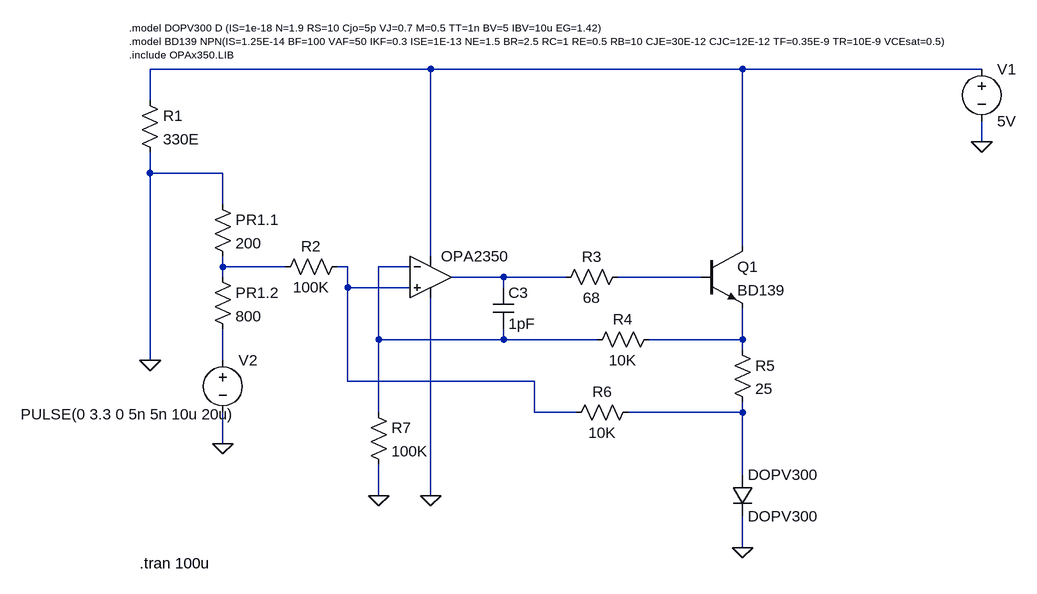
[diagram p0: schematic LaserDriver.asc]
LaserDriver.asc, the LTspice schematic file:
Version 4.1
SHEET 1 2252 680
WIRE 208 -192 -224 -192
WIRE 688 -192 208 -192
WIRE 1056 -192 688 -192
WIRE -224 -144 -224 -192
WIRE 1056 -80 1056 -112
WIRE -224 -32 -224 -64
WIRE -112 -32 -224 -32
WIRE -112 16 -112 -32
WIRE 688 80 688 -192
WIRE 208 96 208 -192
WIRE -112 112 -112 96
WIRE -16 112 -112 112
WIRE 80 112 64 112
WIRE 176 112 128 112
WIRE -112 128 -112 112
WIRE 320 128 240 128
WIRE 416 128 320 128
WIRE 624 128 496 128
WIRE 80 144 80 112
WIRE 176 144 80 144
WIRE 320 144 320 128
WIRE 128 224 128 112
WIRE 320 224 320 208
WIRE 320 224 128 224
WIRE 464 224 320 224
WIRE 688 224 688 176
WIRE 688 224 544 224
WIRE 688 240 688 224
WIRE -224 256 -224 -32
WIRE -112 256 -112 208
WIRE 80 288 80 144
WIRE 368 288 80 288
WIRE 128 336 128 224
WIRE 368 336 368 288
WIRE 432 336 368 336
WIRE 688 336 688 320
WIRE 688 336 512 336
WIRE -112 384 -112 336
WIRE 688 432 688 336
WIRE 128 464 128 416
WIRE 208 464 208 160
WIRE 688 544 688 496
FLAG -224 256 0
FLAG 128 464 0
FLAG 208 464 0
FLAG 688 544 0
FLAG 1056 -80 0
FLAG -112 384 0
DATAFLAG 784 400 "I(DOPV300)"
DATAFLAG 688 352 ""
SYMBOL npn 624 80 R0
SYMATTR InstName Q1
SYMATTR Value BD139
SYMBOL res -240 -160 R0
SYMATTR InstName R1
SYMATTR Value 330E
SYMBOL res -128 112 R0
SYMATTR InstName PR1.2
SYMATTR Value 800
SYMBOL res -128 0 R0
SYMATTR InstName PR1.1
SYMATTR Value 200
SYMBOL res 80 96 R90
WINDOW 0 0 56 VBottom 2
WINDOW 3 32 56 VTop 2
SYMATTR InstName R2
SYMATTR Value 100K
SYMBOL res 112 320 R0
SYMATTR InstName R7
SYMATTR Value 100K
SYMBOL res 512 112 R90
WINDOW 0 0 56 VBottom 2
WINDOW 3 32 56 VTop 2
SYMATTR InstName R3
SYMATTR Value 68
SYMBOL cap 304 144 R0
SYMATTR InstName C3
SYMATTR Value 1pF
SYMBOL res 560 208 R90
WINDOW 0 0 56 VBottom 2
WINDOW 3 32 56 VTop 2
SYMATTR InstName R4
SYMATTR Value 10K
SYMBOL res 528 320 R90
WINDOW 0 0 56 VBottom 2
WINDOW 3 32 56 VTop 2
SYMATTR InstName R6
SYMATTR Value 10K
SYMBOL res 672 224 R0
SYMATTR InstName R5
SYMATTR Value 25
SYMBOL voltage 1056 -208 R0
WINDOW 123 0 0 Left 0
WINDOW 39 0 0 Left 0
SYMATTR InstName V1
SYMATTR Value 5V
SYMBOL diode 672 432 R0
SYMATTR InstName DOPV300
SYMATTR Value DOPV300
SYMBOL OpAmps\\UniversalOpAmp2 208 128 R0
SYMATTR InstName OPA2350
SYMATTR Value2 Avol=1Meg GBW=38Meg Slew=22Meg
SYMATTR SpiceLine2 En=0 Enk=0 In=0 Ink=0 Rin=1G
SYMBOL voltage -112 240 R0
WINDOW 3 -311 99 Left 2
WINDOW 123 0 0 Left 0
WINDOW 39 0 0 Left 0
SYMATTR Value PULSE(0 3.3 0 5n 5n 10u 20u)
SYMATTR InstName V2
TEXT -256 -256 Left 1 !.model DOPV300 D (IS=1e-18 N=1.9 RS=10 Cjo=5p VJ=0.7 M=0.5 TT=1n BV=5 IBV=10u EG=1.42)\n.model BD139 NPN(IS=1.25E-14 BF=100 VAF=50 IKF=0.3 ISE=1E-13 NE=1.5 BR=2.5 RC=1 RE=0.5 RB=10 CJE=30E-12 CJC=12E-12 TF=0.35E-9 TR=10E-9 VCEsat=0.5)\n.include OPAx350.LIB
TEXT -240 568 Left 2 !.tran 100u

The netlist it stands for:
* LaserDriver.asc
Q1 N001 N006 N007 0 BD139
R1 N001 0 330E
R§PR1.2 N002 N008 800
R§PR1.1 0 N002 200
R2 N003 N002 100K
R7 N004 0 100K
R3 N006 N005 68
C3 N005 N004 1pF
R4 N007 N004 10K
R6 N009 N003 10K
R5 N007 N009 25
V1 N001 0 5V
DOPV300 N009 0 DOPV300
X§OPA2350 N003 N004 N001 0 N005 level2 Avol=1Meg GBW=38Meg Slew=22Meg Ilimit=25m Rail=0 Vos=0 En=0 Enk=0 In=0 Ink=0 Rin=1G  ; pins In+ In- V+ V- OUT
V2 N008 0 PULSE(0 3.3 0 5n 5n 10u 20u)
.model D D
.lib standard.dio
.model NPN NPN
.model PNP PNP
.lib standard.bjt
.model DOPV300 D (IS=1e-18 N=1.9 RS=10 Cjo=5p VJ=0.7 M=0.5 TT=1n BV=5 IBV=10u EG=1.42)
.model BD139 NPN(IS=1.25E-14 BF=100 VAF=50 IKF=0.3 ISE=1E-13 NE=1.5 BR=2.5 RC=1 RE=0.5 RB=10 CJE=30E-12 CJC=12E-12 TF=0.35E-9 TR=10E-9 VCEsat=0.5)
.include OPAx350.LIB
.tran 100u
.lib UniversalOpAmp2.lib
.backanno
.end